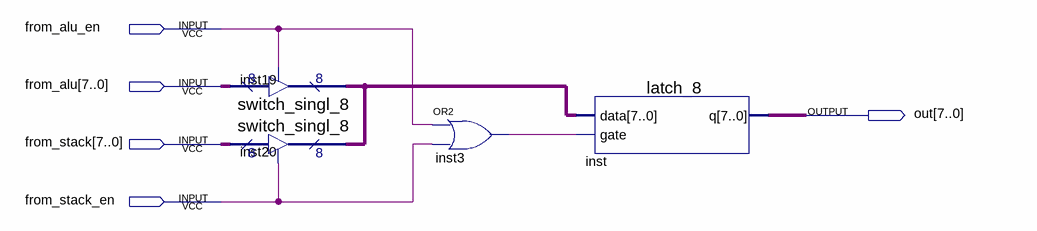
[diagram p0: schematic sheet]
// Quartus schematic flags.bdf as structural Verilog: 4 symbols, 5 pins
module flags (
  input  from_alu_en,
  input  [7:0] from_alu,
  input  [7:0] from_stack,
  input  from_stack_en,
  output [7:0] out
);

  wire inst3_out;
  wire [7:0] inst19_tridata;

  switch_singl_8 inst19 (.enabledt(from_alu_en), .data(from_alu), .tridata(inst19_tridata));
  switch_singl_8 inst20 (.enabledt(from_stack_en), .data(from_stack), .tridata(inst19_tridata));
  or inst3 (inst3_out, from_alu_en, from_stack_en);
  latch_8 inst (.data(inst19_tridata), .gate(inst3_out), .q(out));
endmodule
